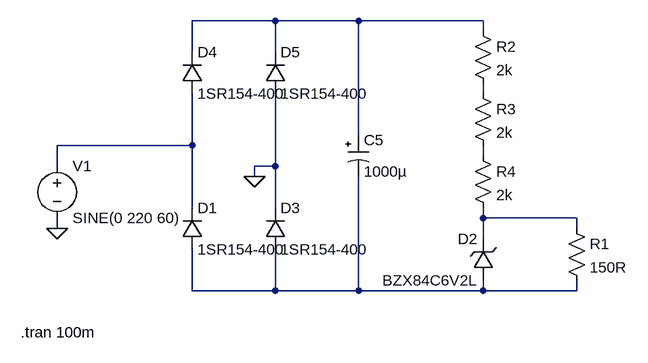
[diagram p0: schematic Fonte DC através de AC.asc]
Fonte DC através de AC.asc, the LTspice schematic file:
Version 4
SHEET 1 880 680
WIRE 64 -48 -64 -48
WIRE 192 -48 64 -48
WIRE 384 -48 192 -48
WIRE 384 -32 384 -48
WIRE -64 0 -64 -48
WIRE 64 0 64 -48
WIRE 384 64 384 48
WIRE 192 128 192 -48
WIRE -64 144 -64 64
WIRE -64 144 -272 144
WIRE 384 160 384 144
WIRE -272 176 -272 144
WIRE 64 176 64 64
WIRE 64 176 32 176
WIRE 32 192 32 176
WIRE -64 240 -64 144
WIRE 64 240 64 176
WIRE 384 256 384 240
WIRE 528 256 384 256
WIRE -272 272 -272 256
WIRE 528 272 528 256
WIRE 384 288 384 256
WIRE -64 368 -64 304
WIRE 64 368 64 304
WIRE 64 368 -64 368
WIRE 192 368 192 192
WIRE 192 368 64 368
WIRE 384 368 384 352
WIRE 384 368 192 368
WIRE 528 368 528 352
WIRE 528 368 384 368
FLAG -272 272 0
FLAG 32 192 0
SYMBOL voltage -272 160 R0
WINDOW 123 0 0 Left 0
WINDOW 39 0 0 Left 0
SYMATTR InstName V1
SYMATTR Value SINE(0 220 60)
SYMBOL diode -80 304 M180
WINDOW 0 24 64 Left 2
WINDOW 3 24 0 Left 2
SYMATTR InstName D1
SYMATTR Value 1SR154-400
SYMBOL zener 400 352 R180
WINDOW 0 24 64 Left 2
WINDOW 3 24 0 Left 2
SYMATTR InstName D2
SYMATTR Value BZX84C6V2L
SYMBOL res 512 256 R0
SYMATTR InstName R1
SYMATTR Value 150R
SYMBOL diode 48 304 M180
WINDOW 0 24 64 Left 2
WINDOW 3 24 0 Left 2
SYMATTR InstName D3
SYMATTR Value 1SR154-400
SYMBOL diode -80 64 M180
WINDOW 0 24 64 Left 2
WINDOW 3 24 0 Left 2
SYMATTR InstName D4
SYMATTR Value 1SR154-400
SYMBOL diode 48 64 M180
WINDOW 0 24 64 Left 2
WINDOW 3 24 0 Left 2
SYMATTR InstName D5
SYMATTR Value 1SR154-400
SYMBOL polcap 176 128 R0
WINDOW 3 24 56 Left 2
SYMATTR Value 1000µ
SYMATTR InstName C5
SYMATTR Description Capacitor
SYMATTR Type cap
SYMATTR SpiceLine V=400 Irms=1.33 Rser=0.047 Lser=0
SYMBOL res 368 -48 R0
SYMATTR InstName R2
SYMATTR Value 2k
SYMBOL res 368 48 R0
SYMATTR InstName R3
SYMATTR Value 2k
SYMBOL res 368 144 R0
SYMATTR InstName R4
SYMATTR Value 2k
TEXT -328 432 Left 2 !.tran 100m

The netlist it stands for:
* Fonte DC através de AC.asc
V1 N003 0 SINE(0 220 60)
D1 N006 N003 1SR154-400
D2 N006 N005 BZX84C6V2L
R1 N005 N006 150R
D3 N006 0 1SR154-400
D4 N003 N001 1SR154-400
D5 0 N001 1SR154-400
C5 N001 N006 1000µ V=400 Irms=1.33 Rser=0.047 Lser=0
R2 N001 N002 2k
R3 N002 N004 2k
R4 N004 N005 2k
.model D D
.lib standard.dio
.tran 100m
.backanno
.end